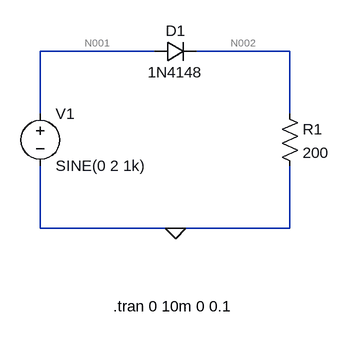
[diagram p0: schematic DIODE.asc]
DIODE.asc, the LTspice schematic file:
Version 4
SHEET 1 880 680
WIRE 192 160 16 160
WIRE 400 160 256 160
WIRE 16 256 16 160
WIRE 400 256 400 160
WIRE 16 432 16 336
WIRE 224 432 16 432
WIRE 400 432 400 336
WIRE 400 432 224 432
FLAG 224 432 0
SYMBOL diode 192 176 R270
WINDOW 0 32 32 VTop 2
WINDOW 3 0 32 VBottom 2
SYMATTR InstName D1
SYMATTR Value 1N4148
SYMBOL res 384 240 R0
SYMATTR InstName R1
SYMATTR Value 200
SYMBOL voltage 16 240 R0
WINDOW 123 0 0 Left 0
WINDOW 39 0 0 Left 0
SYMATTR InstName V1
SYMATTR Value SINE(0 2 1k)
TEXT 128 552 Left 2 !.tran 0 10m 0 0.1

The netlist it stands for:
* DIODE.asc
D1 N001 N002 1N4148
R1 N002 0 200
V1 N001 0 SINE(0 2 1k)
.model D D
.lib standard.dio
.tran 0 10m 0 0.1
.backanno
.end

* Results of the author's LTspice run, read from the files saved beside the schematic
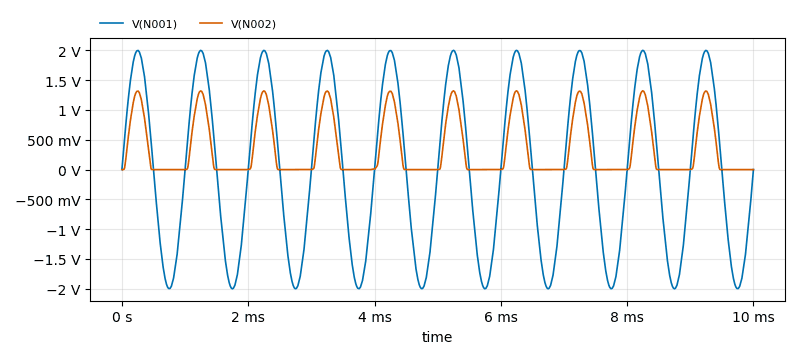
[diagram p1: Transient Analysis of DIODE.asc, plotted from the saved traces]
* Transient Analysis, 1 run:
*   V(N001): min -2 V, max 2 V, average 2.577 mV, rms 1.418 V, last 0 V
*   V(N002): min -9.797 µV, max 1.321 V, average 341 mV, rms 592.4 mV, last 6.349 µV